# EAGLE design RF_TransimpedanceAmp (EAGLE 6.5.0)
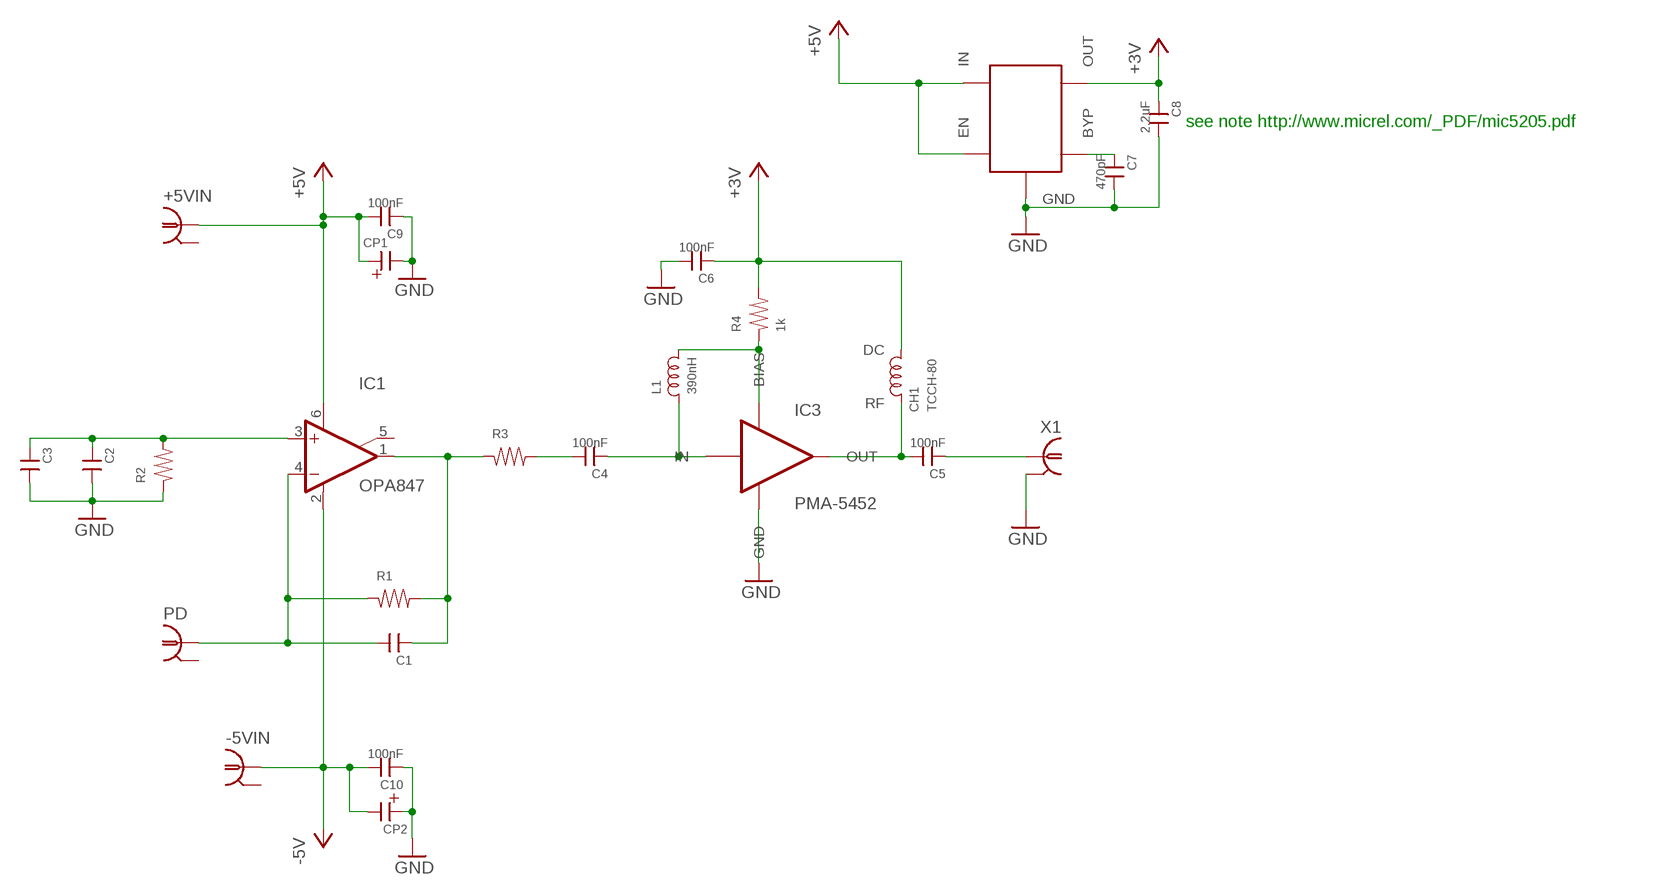
[diagram p0: schematic, sheet 1]

## Parts
+5VIN  UMC  [UMC]
-5VIN  UMC  [UMC]
C1  CAP0201  [0201]
C2  CAP0201  [0201]
C3  CAP0201  [0201]
C4  100nF  CAP0201  [0201]
C5  100nF  CAP0201  [0201]
C6  100nF  CAP0201  [0201]
C7  470pF  CAP0201  [0201]
C8  2.2uF  CAP0402  [0402]
C9  100nF  CAP0201  [0201]
C10  100nF  CAP0201  [0201]
CH1  TCCH-80  [GU1604]
CP1  CAP-POL0603  [0603P]
CP2  CAP-POL0603  [0603P]
IC1  OPA847  OPAMP-6PIN-SOT23-6  [SOT23-6]
IC3  PMA-5452  [DQ849]
L1  390nH  INDUCTOR-0402  [0402]
PD  SMA  [SMA-SMT]
R1  RES0201  [0201]
R2  RES0201  [0201]
R3  RES0201  [0201]
R4  1k  RES0402  [0402]
U$1  MIC5205  [SOT23-5L]
X1  UMC  [UMC]

## Nets
+3V: C6.P$1 C8.1 CH1.P$3(DC) R4.2 U$1.5(OUT)
+5V: +5VIN.P$1 C9.P$2 CP1.1 IC1.6(V+) U$1.1(IN) U$1.3(EN)
-5V: -5VIN.P$1 C10.P$2 CP2.2 IC1.2(V-)
GND: C2.P$2 C3.P$2 C6.P$2 C7.P$2 C8.2 C9.P$1 C10.P$1 CP1.2 CP2.1 IC3.P$GND(GND) R2.P$1 U$1.2(GND) X1.P$2 X1.P$3
N$1: C2.P$1 C3.P$1 IC1.3(+IN) R2.P$2
N$2: C1.P$2 IC1.4(-IN) PD.P$1 R1.P$1
N$3: C1.P$1 IC1.1(OUT) R1.P$2 R3.P$1
N$4: C4.P$2 R3.P$2
N$5: C4.P$1 IC3.P$1(IN) L1.1
N$6: C5.P$2 CH1.P$1(RF) IC3.P$6(OUT)
N$7: C5.P$1 X1.P$1
N$9: IC3.P$7(BIAS) L1.2 R4.1
N$10: C7.P$1 U$1.4(BYP)
Unconnected: +5VIN.P$2 +5VIN.P$3 -5VIN.P$2 -5VIN.P$3 IC1.5(AUX) PD.P$GND PD.P$GND2

## Notes on the sheet
- see note http://www.micrel.com/_PDF/mic5205.pdf

## Library data of the parts
+5VIN -5VIN X1 = connector-jqi:UMC: UMC "ultra-miniature" Coaxial connector.
C1-C10 = rlc-jqi:CAP: SMT Capacitor
CH1 = rf-jqi:TCCH-80: TCCH-80+ RF Choke.
CP1 CP2 = rlc-jqi:CAP-POL: Polarized SMT Capacitor
IC1 = opamp-jqi:OPAMP-6PIN
IC3 = rf-jqi:PMA-5452: Minicircuits PMA-5452+
L1 = rlc-jqi:INDUCTOR: SMT Inductor.
PD = connector-jqi:SMA; DIGIKEY: J819-ND
R1-R4 = rlc-jqi:RES: SMT Resistor
U$1 = regulator-jqi:MIC5205: 150mA Low noise LDO regulator

## Board
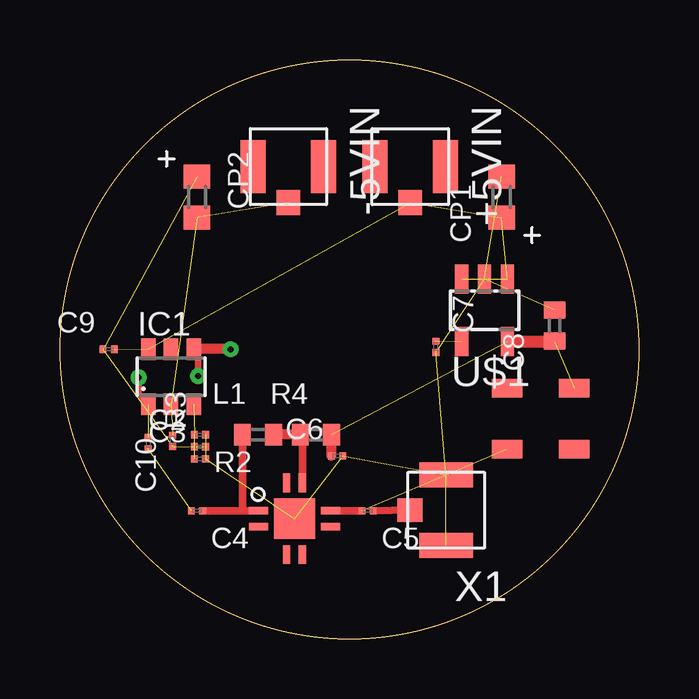
[diagram p1: board, top side]
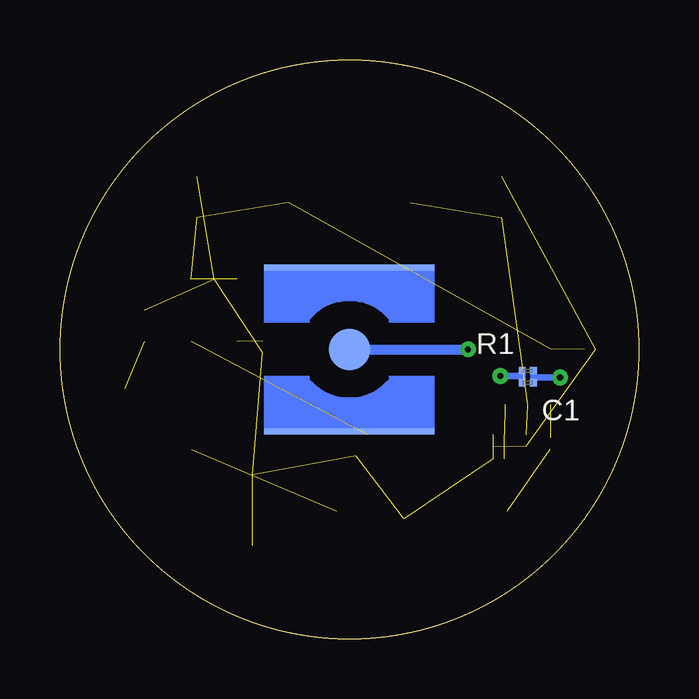
[diagram p2: board, bottom side, seen from below]

Size 24.13 x 24.13 mm. Coordinates in mm from the lower left corner, seen from the top.
Outline: circle at 12.06,12.06 radius 12.06
Copper layers (1*16): Top 0.035mm / dielectric 1.5mm / Bottom 0.035mm
Design rules "default *": minimum track width 10mil, minimum drill 24mil, track to track 8mil, track to pad 6mil, pad to pad 6mil, via to via 8mil, smd to smd 6mil, copper to edge 40mil, drill to drill 8mil, minimum pad ring 10mil, minimum via ring 8mil, stop-mask expansion 4mil, vias tented up to drill 0mil, thermal gap 10mil

### Footprints (pad centres in the part's own frame; a part is rotated, then mirrored left to right if it is on the bottom)
UMC = smd 1.041 x 0.991: P$1 1.511,0 | smd 2.21 x 1.041: P$2 0,1.473; P$3 0,-1.473
0201 = smd 0.28 x 0.3: P$1 -0.235,0; P$2 0.235,0
0402 = smd 0.7 x 0.9: 1 -0.65,0; 2 0.65,0
GU1604 = smd 0.762 x 1.27: P$1 -1.27,1.397; P$2 1.27,1.397; P$3 1.27,-1.397; P$4 -1.27,-1.397
0603P = smd 1 x 1.1: 1 -0.85,0; 2 0.85,0
SOT23-6 = smd 0.6 x 0.9: 1 0,-1.15; 2 0.95,-1.15; 3 1.9,-1.15; 4 1.9,1.15; 5 0.95,1.15; 6 0,1.15
DQ849 = smd 0.787 x 0.305: P$1 -1.499,0; P$2 -1.499,-0.66; P$5 1.499,-0.66; P$6 1.499,0 | smd 0.305 x 0.787: P$3 -0.33,-1.829; P$4 0.33,-1.829; P$7 0.33,1.168; P$8 -0.33,1.168 | smd 1.702 x 1.702: P$GND 0,-0.33
SMA-SMT = smd 1.727 x 1.727: P$1 0,0 | smd 0.254 x 7.112: P$GND -3.416,0; P$GND2 3.416,0
SOT23-5L = smd 0.55 x 1.2: 1 -0.95,-1.3; 2 0,-1.3; 3 0.95,-1.3; 4 0.95,1.3; 5 -0.95,1.3

### Placement (x,y rotation side)
+5VIN  14.61,19.68 270 top
-5VIN  9.52,19.68 270 top
C1  4.62,10.67 180 bottom
C2  5.84,8 0 top
C3  5.84,7.49 0 top
C4  5.71,5.33 180 top
C5  12.83,5.33 180 top
C6  11.56,7.62 0 top
C7  15.67,12.17 270 top
C8  20.62,13.06 90 top
C9  2.03,12.06 0 top
C10  4.7,8.25 90 top
CH1  20.04,9.17 90 top
CP1  18.41,18.41 90 top
CP2  5.71,18.41 270 top
IC1  3.68,10.92 0 top
IC3  9.78,5.33 0 top
L1  8.25,8.51 0 top
PD  12.06,12.06 270 bottom
R1  4.62,11.18 0 bottom
R2  5.84,8.51 180 top
R3  3.68,8.15 270 top
R4  10.67,8.51 0 top
U$1  17.7,13.69 180 top
X1  16.1,5.36 180 top

### Tracks (layer width: path | path; a pad name or v marks a point on that pad's centre or on a via)
+3V  (2 unrouted)
  Top 0.406: C6.P$1 R4.2
  Top 0.508: U$1.5 20.61,12.39 C8.1
+5V  (5 unrouted)
-5V  (3 unrouted)
GND  (13 unrouted)
N$1  (3 unrouted)
N$2  (via drill 0.25)
  Top 0.279: IC1.4 5.77,11.89 v5.77,10.95
  Top 0.406: v7.11,12.06 v7.1,12.07 IC1.4
  Bottom 0.279: C1.P$2 R1.P$1 4.86,10.95 v5.77,10.95 5.74,10.92
  Bottom 0.406: PD.P$1 v7.11,12.06
N$3  (via drill 0.25)  (1 unrouted)
  Top 0.279: IC1.1 3.28,10.18 v3.28,10.9
  Bottom 0.279: v3.28,10.9 4.39,10.9 C1.P$1 R1.P$2
N$4  (1 unrouted)
N$5
  Top 0.305: C4.P$1 IC3.P$1 7.62,5.33 7.62,8.49 L1.1
N$6  (1 unrouted)
  Top 0.305: IC3.P$6 C5.P$2
N$7
  Top 0.305: C5.P$1 X1.P$1
N$8
  cutout Top: 2.67,12.95 6.73,12.95 6.73,8.89 2.67,8.89
  cutout Bottom: 2.67,12.95 6.73,12.95 6.73,8.89 2.67,8.89
N$9
  Top 0.305: IC3.P$7 10.11,8.51 R4.1
  Top 0.406: R4.1 L1.2
N$10  (1 unrouted)